# EAGLE schematic MM2_plates (EAGLE 7.4.0)
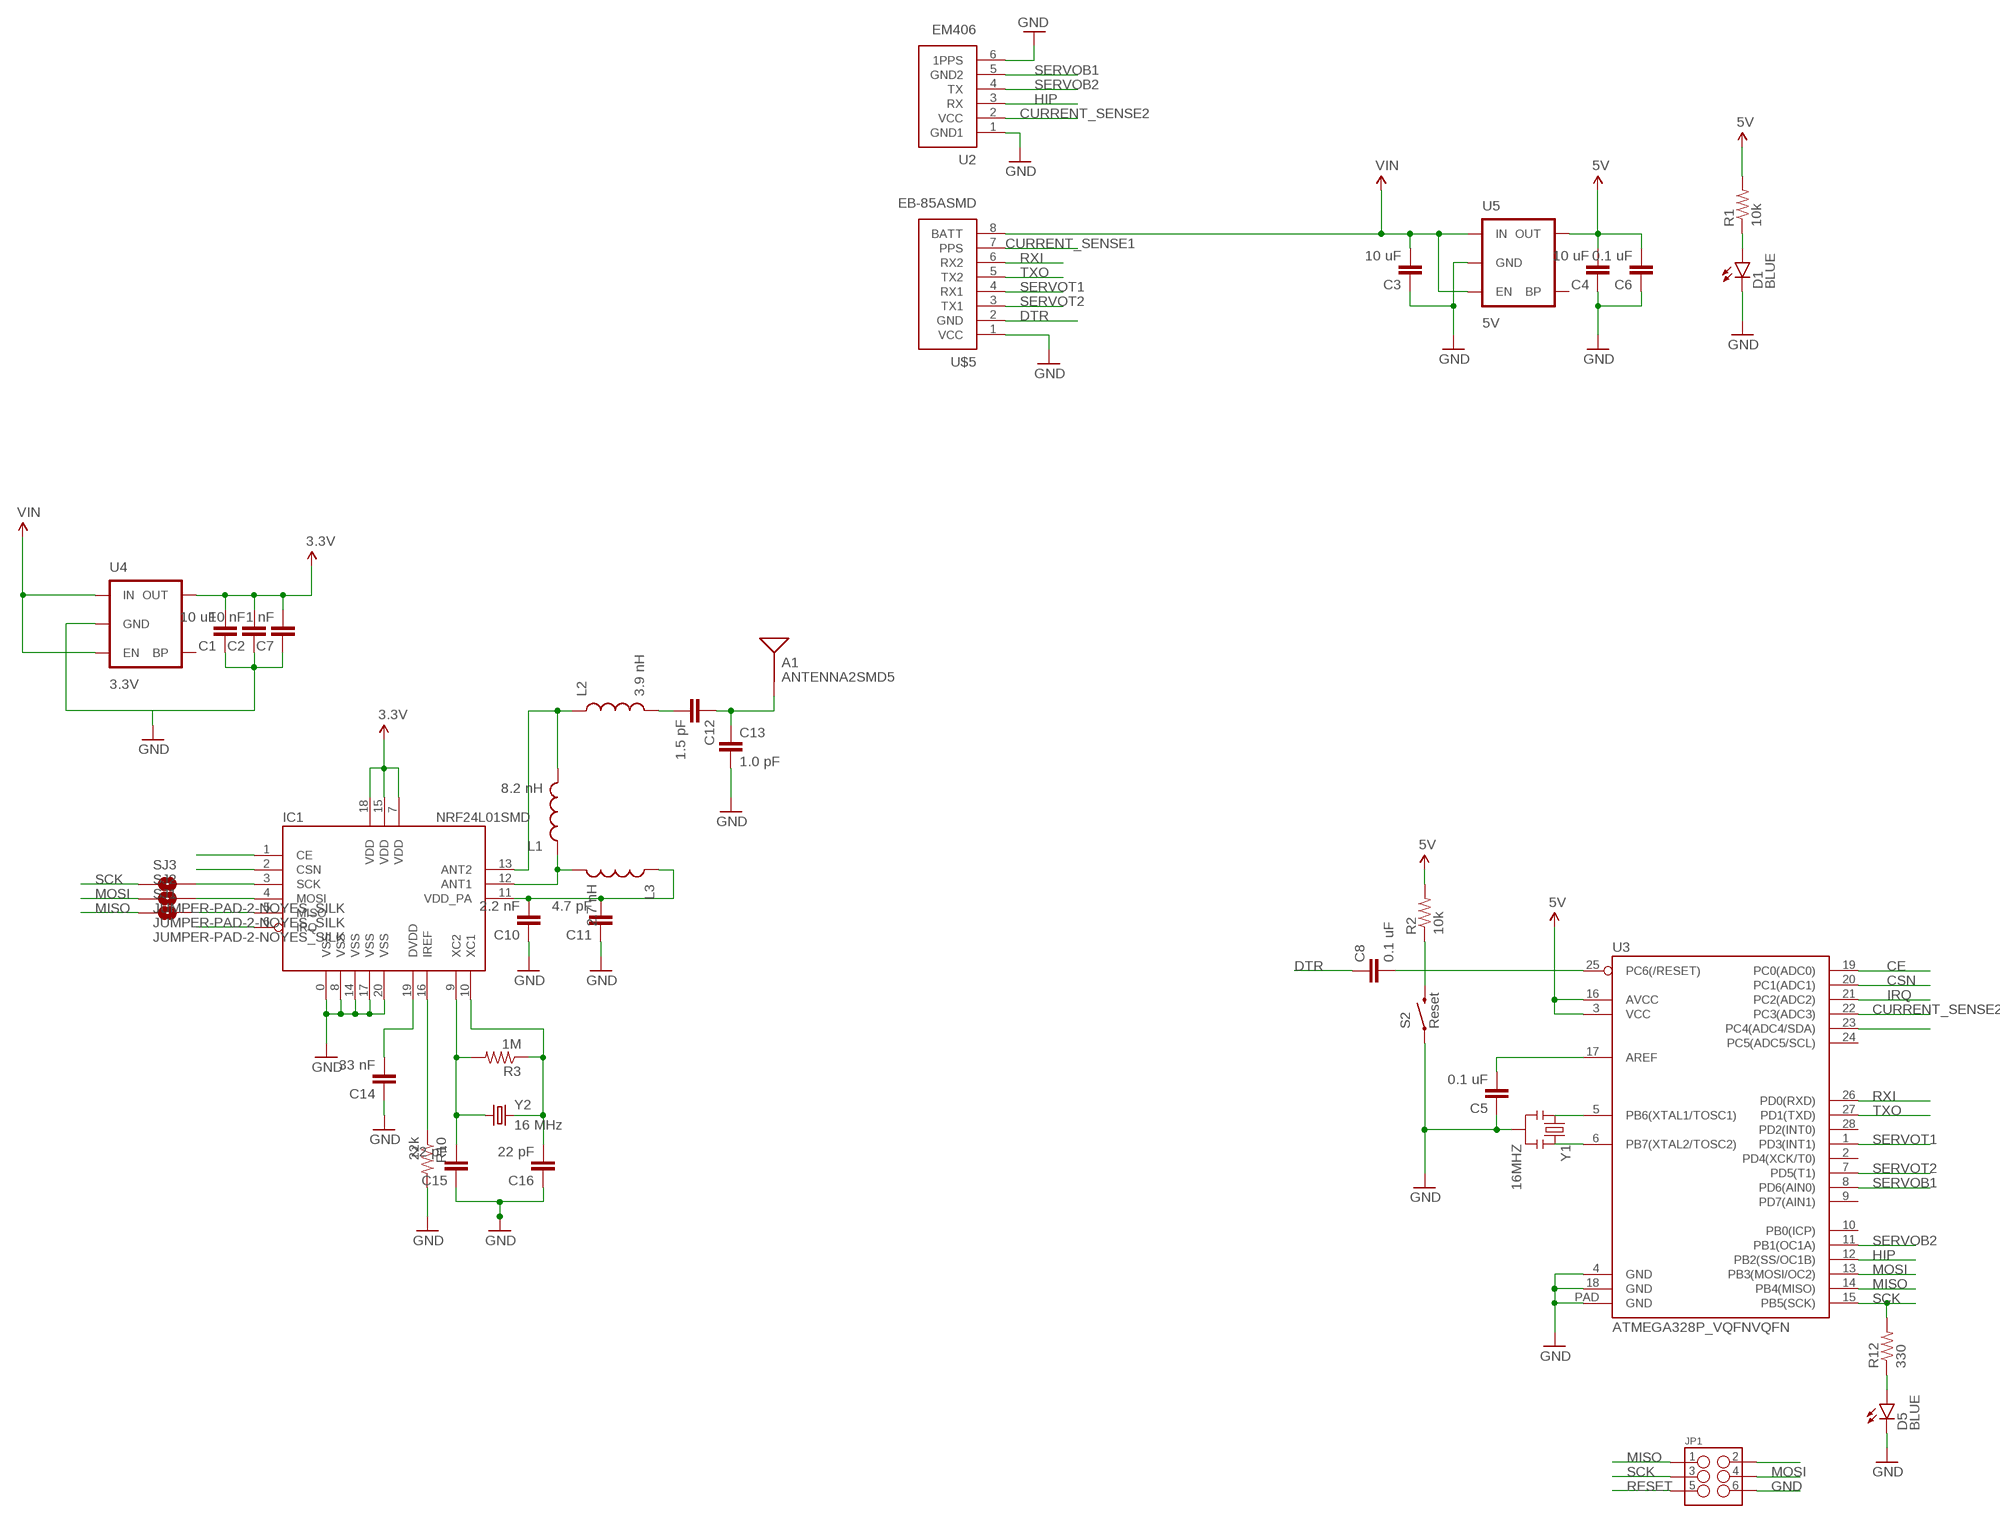
[diagram p0: schematic, sheet 1]

## Parts
A1  ANTENNA2SMD5  [ANTENNA-CHIP5]
C1  10 uF  CAP0402-CAP  [0402-CAP]
C2  10 nF  CAP0402-CAP  [0402-CAP]
C3  10 uF  CAP0402-CAP  [0402-CAP]
C4  10 uF  CAP0402-CAP  [0402-CAP]
C5  0.1 uF  CAP0402-CAP  [0402-CAP]
C6  0.1 uF  CAP0402-CAP  [0402-CAP]
C7  1 nF  CAP0402-CAP  [0402-CAP]
C8  0.1 uF  CAP0402-CAP  [0402-CAP]
C10  2.2 nF  CAP0402-CAP  [0402-CAP]
C11  4.7 pF  CAP0402-CAP  [0402-CAP]
C12  1.5 pF  CAP0402-CAP  [0402-CAP]
C13  1.0 pF  CAP0402-CAP  [0402-CAP]
C14  33 nF  CAP0402-CAP  [0402-CAP]
C15  22 pF  CAP0402-CAP  [0402-CAP]
C16  22 pF  CAP0402-CAP  [0402-CAP]
D1  BLUE  LED-BLUE0603  [LED-0603]
D5  BLUE  LED-BLUE0603  [LED-0603]
IC1  NRF24L01SMD  [QFN20]
JP1  M03X2FEMALE_SMD  [2X3_SMD]
L1  8.2 nH  INDUCTOR0402  [C0402]
L2  3.9 nH  INDUCTOR0402  [C0402]
L3  2.7 nH  INDUCTOR0402  [C0402]
R1  10k  RESISTOR0402-RES  [0402-RES]
R2  10k  RESISTOR0402-RES  [0402-RES]
R3  1M  RESISTOR0402-RES  [0402-RES]
R10  22k  RESISTOR0402-RES  [0402-RES]
R12  330  RESISTOR0402-RES  [0402-RES]
S2  Reset  SWITCH-MOMENTARY-2SMD-4.6X2.8MM  [TACTILE_SWITCH_SMD_4.6X2.8MM]
SJ1  JUMPER-PAD-2-NOYES_SILK  [PAD-JUMPER-2-NO_YES_SILK]
SJ2  JUMPER-PAD-2-NOYES_SILK  [PAD-JUMPER-2-NO_YES_SILK]
SJ3  JUMPER-PAD-2-NOYES_SILK  [PAD-JUMPER-2-NO_YES_SILK]
U2  EM406  [EM406]
U3  ATMEGA328P_VQFNVQFN  [VQFN-28]
U4  3.3V  MIC52053.3V  [SOT23-5]
U5  5V  MIC52055V  [SOT23-5]
U$5  EB-85ASMD  [EB-85A]
Y1  16MHZ  RESONATOR16MHZ  [RESONATOR-SMD]
Y2  16 MHz  CRYSTAL5X3  [CRYSTAL-SMD-5X3]

## Nets
3.3V: C1.2 C2.2 C7.2 IC1.7(VDD) IC1.15(VDD) IC1.18(VDD) U4.5(OUT)
5V: C4.2 C6.2 JP1.2 R1.2 R2.2 U3.3(VCC) U3.16(AVCC) U5.5(OUT)
CE: IC1.1(CE) U3.19(PC0(ADC0))
CSN: IC1.2(CSN) U3.20(PC1(ADC1))
CURRENT_SENSE1: U3.23(PC4(ADC4/SDA)) U$5.7(PPS)
CURRENT_SENSE2: U2.2(VCC) U3.22(PC3(ADC3))
DTR: C8.1 U$5.2(GND)
GND: C1.1 C2.1 C3.1 C4.1 C5.1 C6.1 C7.1 C10.1 C11.1 C13.2 C14.1 C15.1 C16.1 D1.C D5.C IC1.0(VSS) IC1.8(VSS) IC1.14(VSS) IC1.17(VSS) IC1.20(VSS) JP1.6 R10.2 S2.1 S2.2 U2.1(GND1) U2.6(1PPS) U3.4(GND) U3.18(GND) U3.PAD(GND) U4.2(GND) U5.2(GND) U$5.1(VCC) Y1.2
HIP: U2.3(RX) U3.12(PB2(SS/OC1B))
IRQ: IC1.6(IRQ) U3.21(PC2(ADC2))
MISO: JP1.1 SJ1.1 U3.14(PB4(MISO))
MOSI: JP1.4 SJ2.1 U3.13(PB3(MOSI/OC2))
N$6: U3.5(PB6(XTAL1/TOSC1)) Y1.1
N$7: U3.6(PB7(XTAL2/TOSC2)) Y1.3
N$8: D1.A R1.1
N$10: IC1.12(ANT1) L1.1 L3.2
N$11: C5.2 U3.17(AREF)
N$12: IC1.13(ANT2) L1.2 L2.1
N$19: C12.2 L2.2
N$20: D5.A R12.1
N$22: A1.FEED(SIGNAL) C12.1 C13.1
N$23: IC1.3(SCK) SJ3.2
N$24: C10.2 C11.2 IC1.11(VDD_PA) L3.1
N$25: C14.2 IC1.19(DVDD)
N$26: IC1.16(IREF) R10.1
N$27: IC1.4(MOSI) SJ2.2
N$28: C15.2 IC1.9(XC2) R3.2 Y2.1
N$29: C16.2 IC1.10(XC1) R3.1 Y2.3
N$30: IC1.5(MISO) SJ1.2
RESET: C8.2 JP1.5 R2.1 S2.3 S2.4 U3.25(PC6(/RESET))
RXI: U3.26(PD0(RXD)) U$5.6(RX2)
SCK: JP1.3 R12.2 SJ3.1 U3.15(PB5(SCK))
SERVOB1: U2.5(GND2) U3.8(PD6(AIN0))
SERVOB2: U2.4(TX) U3.11(PB1(OC1A))
SERVOT1: U3.1(PD3(INT1)) U$5.4(RX1)
SERVOT2: U3.7(PD5(T1)) U$5.3(TX1)
TXO: U3.27(PD1(TXD)) U$5.5(TX2)
VIN: C3.2 U4.1(IN) U4.3(EN) U5.1(IN) U5.3(EN) U$5.8(BATT)
Unconnected: U3.2(PD4(XCK/T0)) U3.9(PD7(AIN1)) U3.10(PB0(ICP)) U3.24(PC5(ADC5/SCL)) U3.28(PD2(INT0)) U4.4(BP) U5.4(BP)

## Library data of the parts
A1 = SparkFun-RF:ANTENNA2: Chip antenna Single endded antenna. Common with smaller chip antennas. CHIP4 package is the GPS Chip Antenna SKU: GPS-08418. CHIP5 package is 2.4GHz chip antenna SKU: WRL-00144.
C1-C8 C10-C16 = SparkFun-Passives:CAP: Capacitor Standard 0603 ceramic capacitor, and 0.1" leaded capacitor.
D1 D5 = SparkFun-LED:LED-BLUE: Blue LEDs for production use Various blue LEDs stocked by SparkFun production 0603 - DIO-08575 Rebel - DIO-09553 1206 - DIO-09911; PROD_ID: DIO-08575
IC1 = SparkFun-RF:NRF24L01: 2.4GHz Low Power Transceiver This is the very popular, low cost, very low power RF transceiver from Nordic Semiconductor. Simple SPI interface. SKU: COM-00690
JP1 = SparkFun-Connectors:M03X2: 2x3 .1" header. Shrouded, with keying- CONN-10681 SMT- CONN-11415 Pogo pins- HW-11044; PROD_ID: CONN-11290
L1-L3 = SparkFun-Passives:INDUCTOR: Inductors Basic Inductor/Choke - 0603 and 1206. Footprints are not proven and vary greatly between part numbers. SRN6045- 33uH, 20% 1.4A SDR0403-560KL - 56uH, 10%, 500mA RMS/740mA peak
R1-R3 R10 R12 = SparkFun-Passives:RESISTOR: Resistor Basic schematic elements and footprints for 0603, 1206, and PTH resistors.
S2 = SparkFun-Electromechanical:SWITCH-MOMENTARY-2: Various NO switches- pushbuttons, reed, etc; PROD_ID: SWCH-13065
SJ1-SJ3 = SparkFun-Passives:JUMPER-PAD-2-NO
U2 = SparkFun-Connectors:EM406: EM406 GPS Connector Proven layout and schematic for EM406 connector. Spark Fun Electronics SKU : GPS-00579
U3 = SparkFun-DigitalIC:ATMEGA328P_VQFN
U4 = SparkFun-PowerIC:MIC5205: MIC5205 150mA vreg 3.3V - VREG-00822 5V - VREG-00823; PROD_ID: VREG-00822
U5 = SparkFun-PowerIC:MIC5205: MIC5205 150mA vreg 3.3V - VREG-00822 5V - VREG-00823; PROD_ID: VREG-00823
U$5 = SparkFun-Connectors:EB-85A: EB-85A Connector Proven layout and schematic for ETek 5Hz GPS receiver connector. Spark Fun Electronics SKU : GPS-08297
Y1 = SparkFun-FreqCtrl:RESONATOR: Resonator Small SMD resonator. Used, eg, on the Arduino Pro/ Pro Mini boards. 8MHz- XTAL-08895 16MHz- XTAL-08900; PROD_ID: XTAL-08900
Y2 = SparkFun-FreqCtrl:CRYSTAL: Various standard crystals. Proven footprints.; PROD_ID: XTAL-08218